# Altium project Stm32103f.PrjPcb
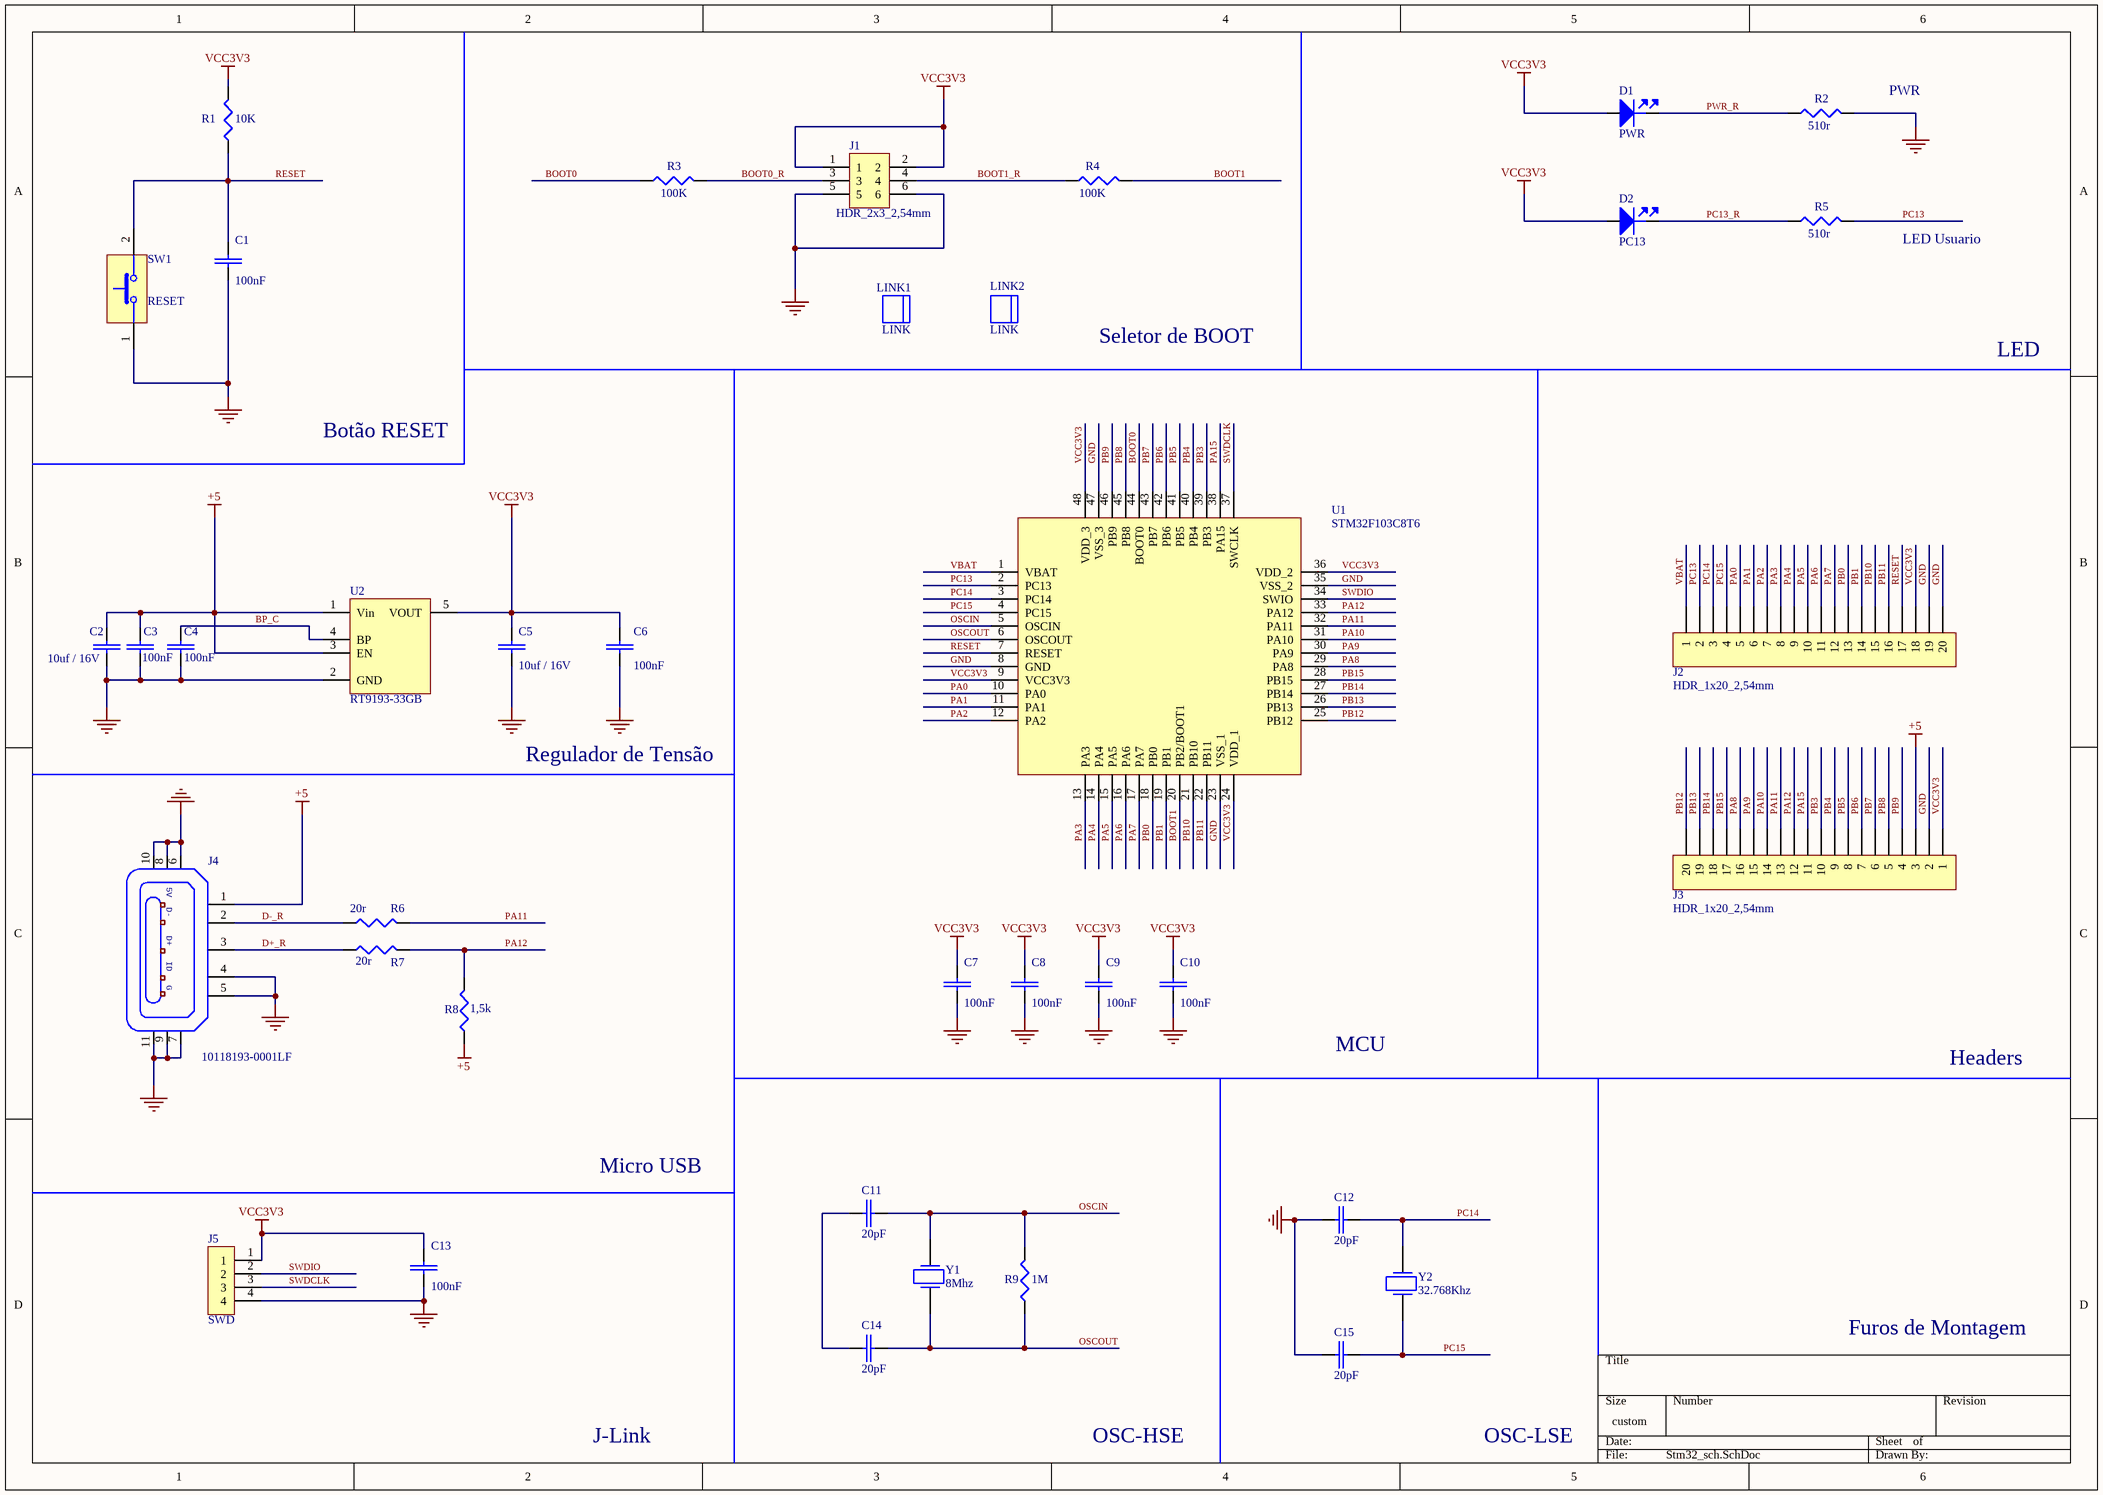
[diagram p0: Stm32_sch.SchDoc]
1 sheet, 38 parts. Net scope: global (net labels, ports and power ports of the same name join across sheets).
Board files: Stm32_pcb_Variante_2lados.PcbDoc, Stm32_pcb.PcbDoc

## Sheet Stm32_sch.SchDoc
size 393 x 279 mm; SheetNumber: 1; SheetTotal: 1

### Parts
C1  100nF  [CP-0603]
C2  10uf / 16V  [CP_0805]
C3  100nF  [CP-0603]
C4  100nF  [CP-0603]
C5  10uf / 16V  [CP_0805]
C6  100nF  [CP-0603]
C7  100nF  [CP-0603]
C8  100nF  [CP-0603]
C9  100nF  [CP-0603]
C10  100nF  [CP-0603]
C11  20pF  [CP-0603]
C12  20pF  [CP-0603]
C13  100nF  [CP-0603]
C14  20pF  [CP-0603]
C15  20pF  [CP-0603]
D1  PWR  [LED_Green]
D2  PC13  [LED_Orange]
J1  HDR_2x3_2,54mm  [Header Male 2x3 2,54mm]
J2  HDR_1x20_2,54mm  [HDR_1x20_2,54mm]
J3  HDR_1x20_2,54mm  [HDR2_1x20_2,54mm]
J4  10118193-0001LF  [Micro-Usb]
J5  SWD  [HDR_M 1x4 2.54mm]
LINK1  LINK  (mechanical)
LINK2  LINK  (mechanical)
R1  10K  [R-0603]
R2  510r  [R-0603]
R3  100K  [R-0603]
R4  100K  [R-0603]
R5  510r  [R-0603]
R6  20r  [R-0603]
R7  20r  [R-0603]
R8  1,5k  [R-0603]
R9  1M  [R-0603]
SW1  RESET  [Push Button]
U1  STM32F103C8T6  [Stm32f1]
U2  RT9193-33GB  [SOT_23_5]
Y1  8Mhz  [CK_8Mhz]
Y2  32.768Khz  [CK_32.768Khz]

### Nets
+5: C2.2 C3.2 J3.3 J4.1 R8.1 U2.1(Vin) U2.3(EN)
GND: C1.1 C2.1 C3.1 C4.1 C5.1 C6.1 C7.1 C8.1 C9.1 C10.1 C12.1 C13.1 C15.1 J1.5 J1.6 J2.19 J2.20 J3.2 J4.4 J4.5 J4.6 J4.7 J4.8 J4.9 J4.10 J4.11 J5.4 R2.2 SW1.1 U1.8(GND) U1.23(VSS_1) U1.35(VSS_2) U1.47(VSS_3) U2.2(GND)
VCC3V3: C5.2 C6.2 C7.2 C8.2 C9.2 C10.2 C13.2 D1.2(ANODE) D2.2(ANODE) J1.1 J1.2 J2.18 J3.1 J5.1 R1.2 U1.9(VCC3V3) U1.24(VDD_1) U1.36(VDD_2) U1.48(VDD_3) U2.5(VOUT)
BOOT0: R3.1 U1.44(BOOT0)
BOOT0_R: J1.3 R3.2
BOOT1: R4.2 U1.20(PB2/BOOT1)
BOOT1_R: J1.4 R4.1
BP_C: C4.2 U2.4(BP)
D+_R: J4.3 R7.1
D-_R: J4.2 R6.1
OSCIN: C11.2 R9.2 U1.5(OSCIN) Y1.2
OSCOUT: C14.2 R9.1 U1.6(OSCOUT) Y1.1
PA0: J2.5 U1.10(PA0)
PA1: J2.6 U1.11(PA1)
PA2: J2.7 U1.12(PA2)
PA3: J2.8 U1.13(PA3)
PA4: J2.9 U1.14(PA4)
PA5: J2.10 U1.15(PA5)
PA6: J2.11 U1.16(PA6)
PA7: J2.12 U1.17(PA7)
PA8: J3.16 U1.29(PA8)
PA9: J3.15 U1.30(PA9)
PA10: J3.14 U1.31(PA10)
PA11: J3.13 R6.2 U1.32(PA11)
PA12: J3.12 R7.2 R8.2 U1.33(PA12)
PA15: J3.11 U1.38(PA15)
PB0: J2.13 U1.18(PB0)
PB1: J2.14 U1.19(PB1)
PB3: J3.10 U1.39(PB3)
PB4: J3.9 U1.40(PB4)
PB5: J3.8 U1.41(PB5)
PB6: J3.7 U1.42(PB6)
PB7: J3.6 U1.43(PB7)
PB8: J3.5 U1.45(PB8)
PB9: J3.4 U1.46(PB9)
PB10: J2.15 U1.21(PB10)
PB11: J2.16 U1.22(PB11)
PB12: J3.20 U1.25(PB12)
PB13: J3.19 U1.26(PB13)
PB14: J3.18 U1.27(PB14)
PB15: J3.17 U1.28(PB15)
PC13: J2.2 R5.2 U1.2(PC13)
PC13_R: D2.1(KAT) R5.1
PC14: C12.2 J2.3 U1.3(PC14) Y2.2
PC15: C15.2 J2.4 U1.4(PC15) Y2.1
PWR_R: D1.1(KAT) R2.1
RESET: C1.2 J2.17 R1.1 SW1.2 U1.7(RESET)
SWDCLK: J5.3 U1.37(SWCLK)
SWDIO: J5.2 U1.34(SWIO)
VBAT: J2.1 U1.1(VBAT)
NetC11_1: C11.1 C14.1

### Notes on the sheet
- (near R2) PWR
- LED Usuario
- Seletor de BOOT
- LED
- Botão RESET
- Regulador de Tensão
- MCU
- Headers
- Micro USB
- Furos de Montagem
- J-Link
- OSC-HSE
- OSC-LSE
- (in symbol Micro-Usb) 5V; D-; D+; ID; G

### Library data of the parts
C1 C3 C4 C6-C10 C13 = C-0603_100nF: Multilayer Ceramic Capacitors (MLCC) - SMD/SMT 50volts 0.1uF X7R 10%; Manufacturer: KEMET; Manufacturer Part Number: C0603C104K5RACTU; Voltage Rating (DC): 50V; Dissipation Factor: 2.5%; Supplier 1: Digi-Key; RoHS: Yes; Category: Ceramic Capacitors; Stock 1: 8270795; Pricing 1: 1=0,11000, 10=0,08100, 50=0,04400, 100=0,03600, 500=0,02572, 1000=0,02021 (USD); Mount: Surface Mount; Case/Package: 0603; Number of Pins: 2; Case Code (Metric): 1608; Case Code (Imperial): 0603; Contact Plating: Tin,Matte; Dielectric Material: Ceramic; Min Operating Temperature: -55°C; Max Operating Temperature: 125°C; Capacitance: 100nF; Tolerance: 10%; Dielectric: X7R; Voltage Rating: 50V; Packaging: Tape and Reel; Package Quantity: 1; Termination: SMD/SMT; Voltage: 50V; Series: SMD Comm X7R; Length: 0.063inch; Width: 0.031inch; Height: 0.8mm; Thickness: 0.034inch; Lead Pitch: 0.7mm; Depth: 0.8mm; Radiation Hardening: No; REACH SVHC: No SVHC; RoHS Compliant: Yes; Supplier Part Number 1: 399-C0603C104K5RAC7867CT-ND
C2 C5 = C-0805 10uF / 16V: TDK - C2012X5R1C106M085AC - SMD Multilayer Ceramic Capacitor, 10 µF, 16 V, 0805 [2012 Metric], ± 20%, X5R, C Series TDK; Supplier 1: Digi-Key; Manufacturer: TDK; Manufacturer Part Number: C2012X5R1C106M085AC; RoHS: Yes; Category: Ceramic Capacitors; Stock 1: 520514; Pricing 1: 1=0,28000, 10=0,19000, 50=0,11380, 100=0,09610, 500=0,06578, 1000=0,05819 (USD); Mount: Surface Mount; Case/Package: 0805; Number of Pins: 2; Case Code (Metric): 2012; Case Code (Imperial): 0805; Weight: 0.000194oz; Dielectric Material: Ceramic; Min Operating Temperature: -55°C; Max Operating Temperature: 85°C; Packaging: Tape and Reel; Capacitance: 10uF; Voltage Rating: 16V; Tolerance: 20%; Termination: SMD/SMT; Package Quantity: 4000; Voltage Rating (DC): 16V; Dielectric: X5R; Resistor Type: Ceramic; Series: C; Construction: Flat; Voltage: 16V; Length: 2mm; Width: 0.049inch; Height: 0.85mm; Thickness: 0.037inch; Depth: 1.25mm; REACH SVHC: No SVHC; Lead Free: Lead Free; ComponentLink1URL: https://datasheet.ciiva.com/24218/c2012x5r1c106m085ac-265002-24218340.pdf?src-supplier=Mouser; ComponentLink1Description: https://datasheet.ciiva.com/24218/c2012x5r1c106m085ac-265002-24218340.pdf?src-supplier=Mouser; ComponentLink2URL: https://datasheet.ciiva.com/11788/0900766b80c1bb00-11788108.pdf?src-supplier=RSComponents; ComponentLink2Description: https://datasheet.ciiva.com/11788/0900766b80c1bb00-11788108.pdf?src-supplier=RSComponents; ComponentLink3URL: https://datasheet.ciiva.com/6290/tdkmlcccaprange-6290487.pdf?src-supplier=Digi-Key; ComponentLink3Description: https://datasheet.ciiva.com/6290/tdkmlcccaprange-6290487.pdf?src-supplier=Digi-Key; ComponentLink4URL: https://datasheet.ciiva.com/6290/tdkmlcccaprange-6290485.pdf?src-supplier=Digi-Key; ComponentLink4Description: https://datasheet.ciiva.com/6290/tdkmlcccaprange-6290485.pdf?src-supplier=Digi-Key; ComponentLink5URL: https://datasheet.ciiva.com/16449/e412-c-16449591.pdf?src-supplier=Future+Electronics; ComponentLink5Description: https://datasheet.ciiva.com/16449/e412-c-16449591.pdf?src-supplier=Future+Electronics; ComponentLink6URL: https://datasheet.ciiva.com/22725/1913358-22725557.pdf?src-supplier=Element14; ComponentLink6Description: https://datasheet.ciiva.com/22725/1913358-22725557.pdf?src-supplier=Element14; ComponentLink7URL: https://datasheet.ciiva.com/23803/1796654-23803021.pdf?src-supplier=Newark; ComponentLink7Description: https://datasheet.ciiva.com/23803/1796654-23803021.pdf?src-supplier=Newark; Supplier Part Number 1: 445-7645-1-ND
C11 C12 C14 C15 = C-0603_20pF: Cap Ceramic 20pF 50V C0G 2% SMD 0603 125°C Paper T/R; Manufacturer: KEMET; Manufacturer Part Number: C0603C200G5GAC7867; Supplier 1: Digi-Key; RoHS: Yes; Category: Ceramic Capacitors; Stock 1: 1306; Pricing 1: 1=0,68000, 10=0,47800, 50=0,36140, 100=0,31470, 500=0,23310, 1000=0,19814 (USD); Mount: Surface Mount; Case/Package: 0603; Dielectric Material: Ceramic; Min Operating Temperature: -55°C; Max Operating Temperature: 125°C; Capacitance: 20pF; Tolerance: 2%; Dielectric: C0G; Voltage Rating (DC): 50V; Length: 1.6mm; Height: 0.8mm; Depth: 0.8mm; Radiation Hardening: No; Lead Free: Lead Free; ComponentLink1URL: https://api.kemet.com/component-edge/download/datasheet/C0603C200G5GACTU.pdf?src-supplier=Digi-Key; ComponentLink1Description: https://api.kemet.com/component-edge/download/datasheet/C0603C200G5GACTU.pdf?src-supplier=Digi-Key; ComponentLink2URL: http://capacitoredge.kemet.com/capedge2/DataSheet?pn=C0603C200G5GAC7867; ComponentLink2Description: http://capacitoredge.kemet.com/capedge2/DataSheet?pn=C0603C200G5GAC7867; Supplier Part Number 1: 399-14497-1-ND
D1 = LED_Green: LED Uni-Color Green 2-Pin Chip 0603(1608Metric) T/R; Manufacturer: Osram Opto; Manufacturer Part Number: LG Q396-PS-35; Lens Color: White; Dominant Wavelength: 573nm; Lens Style: Flat,Rectangular; Lens Transparency: Diffused; Luminous Intensity: 163mcd; Test Current: 20mA; Viewing Angle: 120°; Forward Voltage: 2V; Lens Size: 0.8mm; Supplier 1: Digi-Key; RoHS: Yes; Category: LEDs; Mount: Surface Mount; Case/Package: 0603; Color: Green; Case Code (Imperial): 0603; Case Code (Metric): 1608; Packaging: Tape and Reel; Forward Current: 20mA; Wavelength: 573nm; Length: 1.6mm; Width: 0.8mm; Height: 0.4mm; REACH SVHC: No SVHC; RoHS Compliant: Yes; ComponentLink1URL: http://www.farnell.com/datasheets/2057314.pdf?src-supplier=Farnell; ComponentLink1Description: http://www.farnell.com/datasheets/2057314.pdf?src-supplier=Farnell; ComponentLink2URL: http://www.farnell.com/datasheets/2057314.pdf?src-supplier=Element14; ComponentLink2Description: http://www.farnell.com/datasheets/2057314.pdf?src-supplier=Element14; ComponentLink3URL: https://dammedia.osram.info/media/resource/hires/osram-dam-2493948/LG%20Q396.pdf?src-supplier=Digi-Key; ComponentLink3Description: https://dammedia.osram.info/media/resource/hires/osram-dam-2493948/LG%20Q396.pdf?src-supplier=Digi-Key; ComponentLink4URL: http://www.farnell.com/datasheets/2057314.pdf?src-supplier=Newark; ComponentLink4Description: http://www.farnell.com/datasheets/2057314.pdf?src-supplier=Newark; ComponentLink5URL: http://www.osram-os.com/Graphics/XPic6/00153197_0.pdf?src-supplier=Digi-Key; ComponentLink5Description: http://www.osram-os.com/Graphics/XPic6/00153197_0.pdf?src-supplier=Digi-Key; Supplier Part Number 1: LGQ396-PS-35-ND
D2 = LED_Orange: Smartled Orange Lc; Manufacturer: Osram Opto; Manufacturer Part Number: LOL29K-H2K1-24-Z; Lens Color: White; Forward Current: 20mA; Forward Voltage: 2.2V; Luminous Intensity: 9mcd; Viewing Angle: 160°; Lens Style: Flat,Diffused,Colorless,Rectangular; Test Current: 2mA; Dominant Wavelength: 606nm; Luminous Flux: 0.025lm; Number of LEDs: 1; Lens Transparency: Diffused; Reverse Voltage: 12V; Lens Size: 0.8mm; Supplier 1: Arrow Electronics; RoHS: Yes; Category: Uncategorized; Mount: Surface Mount; Case/Package: 0603; Number of Pins: 2; Color: Orange; Case Code (Metric): 1608; Case Code (Imperial): 0603; Min Operating Temperature: -40°C; Max Operating Temperature: 100°C; Illumination Color: Orange; Packaging: Tape and Reel; Package Quantity: 5000; Number of Elements: 1; Series: SmartLED; Length: 1.3mm; Width: 0.8mm; Height: 0.65mm; Depth: 0.8mm; Radiation Hardening: No; RoHS Compliant: Yes; ComponentLink1URL: https://datasheet.ciiva.com/2112/00077105-0-2112905.pdf?src-supplier=Digi-Key; ComponentLink1Description: https://datasheet.ciiva.com/2112/00077105-0-2112905.pdf?src-supplier=Digi-Key; ComponentLink2URL: https://datasheet.ciiva.com/2112/00077105-0-2112904.pdf?src-supplier=Digi-Key; ComponentLink2Description: https://datasheet.ciiva.com/2112/00077105-0-2112904.pdf?src-supplier=Digi-Key; ComponentLink3URL: https://datasheet.ciiva.com/2112/00077105-0-2112906.pdf?src-supplier=Digi-Key; ComponentLink3Description: https://datasheet.ciiva.com/2112/00077105-0-2112906.pdf?src-supplier=Digi-Key; ComponentLink4URL: https://datasheet.ciiva.com/15198/getdatasheetpartid-693885-15198412.pdf?src-supplier=Verical; ComponentLink4Description: https://datasheet.ciiva.com/15198/getdatasheetpartid-693885-15198412.pdf?src-supplier=Verical; Supplier Part Number 1: LO L29K-H2K1-24-Z
J1 = HDR_2x3_2,54mm: 2.54mm (0.1") Pitch DIL Vertical PC Tail Pin Header, 8.5mm mating pin height, tin, 3+3 contacts; Manufacturer: Harwin; Manufacturer Part Number: M20-9970346; Number of Contacts: 6; Max Current Rating: 3A; Contact Resistance: 30mR; Insulation Resistance: 10GR; Connector Type: Male Pin; Row Spacing: 0.1inch; Supplier 1: Digi-Key; RoHS: Yes; Category: Headers and Wire Housings; Stock 1: 1303; Pricing 1: 1=0,44000, 10=0,37400, 100=0,29070, 500=0,24916, 1000=0,20764, 5000=0,17798, 10000=0,16611 (USD); Mount: Through Hole; Contact Plating: Tin; Contact Material: Brass,Bronze; Color: Black; Housing Color: Black; Housing Material: Nylon; Min Operating Temperature: -40°C; Max Operating Temperature: 105°C; Number of Rows: 2; Termination: Solder; Package Quantity: 1000; Current Rating: 3A; Number of Positions: 6; Packaging: Bulk; Orientation: Straight; Series: M20; Contact Type: Male Pin; Length: 7.62mm; Pitch: 2.54mm; Contact Mating Length: 0.335inch; Depth: 5.08mm; REACH SVHC: No SVHC; ComponentLink1URL: https://datasheet.ciiva.com/5162/m20-997-351477-5162774.pdf?src-supplier=Mouser; ComponentLink1Description: https://datasheet.ciiva.com/5162/m20-997-351477-5162774.pdf?src-supplier=Mouser; ComponentLink2URL: https://datasheet.ciiva.com/11747/0900766b80da602a-11747466.pdf?src-supplier=RSComponents; ComponentLink2Description: https://datasheet.ciiva.com/11747/0900766b80da602a-11747466.pdf?src-supplier=RSComponents; Supplier Part Number 1: 952-3290-ND
J2 = HDR_1x20_p1: 2.54mm (0.1") Pitch SIL Vertical PC Tail Pin Header, 6.1mm mating pin height, tin, 20 contacts; Manufacturer: Harwin; Manufacturer Part Number: M20-9992046; Number of Contacts: 20; Current Rating: 3A; Contact Resistance: 30mR; Gender: Male; Insulation Resistance: 10GR; Connector Type: Male Pin; Supplier 1: Digi-Key; RoHS: Yes; Category: Headers and Wire Housings; Stock 1: 425; Pricing 1: 1=0,81000, 10=0,70300, 100=0,57960, 500=0,50400, 1000=0,41580, 5000=0,36540, 10000=0,34020 (USD); Mount: Through Hole; Case/Package: SIL; Contact Plating: Tin; Contact Material: Brass,Bronze; Color: Black; Housing Color: Black; Housing Material: Nylon; Min Operating Temperature: -40°C; Max Operating Temperature: 105°C; Number of Rows: 1; Termination: Solder; Max Current Rating: 3A; Package Quantity: 200; Packaging: Bulk; Number of Positions: 20; Orientation: Straight; Series: M20; Contact Type: Male Pin; Length: 50.8mm; Pitch: 2.54mm; Contact Mating Length: 0.24inch; Depth: 2.54mm; REACH SVHC: No SVHC; RoHS Compliant: Yes; ComponentLink1URL: https://datasheet.ciiva.com/11746/0900766b80da602d-11746823.pdf?src-supplier=RSComponents; ComponentLink1Description: https://datasheet.ciiva.com/11746/0900766b80da602d-11746823.pdf?src-supplier=RSComponents; ComponentLink2URL: https://datasheet.ciiva.com/9480/m20-999-9480261.pdf?src-supplier=Avnet; ComponentLink2Description: https://datasheet.ciiva.com/9480/m20-999-9480261.pdf?src-supplier=Avnet; ComponentLink3URL: https://datasheet.ciiva.com/5162/m20-999-351179-5162878.pdf?src-supplier=Mouser; ComponentLink3Description: https://datasheet.ciiva.com/5162/m20-999-351179-5162878.pdf?src-supplier=Mouser; ComponentLink4URL: https://datasheet.ciiva.com/6814/m20-999-6814908.pdf?src-supplier=Digi-Key; ComponentLink4Description: https://datasheet.ciiva.com/6814/m20-999-6814908.pdf?src-supplier=Digi-Key; ComponentLink5URL: https://datasheet.ciiva.com/8046/315376-8046943.pdf?src-supplier=Element14; ComponentLink5Description: https://datasheet.ciiva.com/8046/315376-8046943.pdf?src-supplier=Element14; Supplier Part Number 1: 952-1902-ND
J3 = HDR_1x20_p2: 2.54mm (0.1") Pitch SIL Vertical PC Tail Pin Header, 6.1mm mating pin height, tin, 20 contacts; Manufacturer: Harwin; Manufacturer Part Number: M20-9992046; Number of Contacts: 20; Current Rating: 3A; Contact Resistance: 30mR; Gender: Male; Insulation Resistance: 10GR; Connector Type: Male Pin; Supplier 1: Digi-Key; RoHS: Yes; Category: Headers and Wire Housings; Stock 1: 425; Pricing 1: 1=0,81000, 10=0,70300, 100=0,57960, 500=0,50400, 1000=0,41580, 5000=0,36540, 10000=0,34020 (USD); Mount: Through Hole; Case/Package: SIL; Contact Plating: Tin; Contact Material: Brass,Bronze; Color: Black; Housing Color: Black; Housing Material: Nylon; Min Operating Temperature: -40°C; Max Operating Temperature: 105°C; Number of Rows: 1; Termination: Solder; Max Current Rating: 3A; Package Quantity: 200; Packaging: Bulk; Number of Positions: 20; Orientation: Straight; Series: M20; Contact Type: Male Pin; Length: 50.8mm; Pitch: 2.54mm; Contact Mating Length: 0.24inch; Depth: 2.54mm; REACH SVHC: No SVHC; RoHS Compliant: Yes; ComponentLink1URL: https://datasheet.ciiva.com/11746/0900766b80da602d-11746823.pdf?src-supplier=RSComponents; ComponentLink1Description: https://datasheet.ciiva.com/11746/0900766b80da602d-11746823.pdf?src-supplier=RSComponents; ComponentLink2URL: https://datasheet.ciiva.com/9480/m20-999-9480261.pdf?src-supplier=Avnet; ComponentLink2Description: https://datasheet.ciiva.com/9480/m20-999-9480261.pdf?src-supplier=Avnet; ComponentLink3URL: https://datasheet.ciiva.com/5162/m20-999-351179-5162878.pdf?src-supplier=Mouser; ComponentLink3Description: https://datasheet.ciiva.com/5162/m20-999-351179-5162878.pdf?src-supplier=Mouser; ComponentLink4URL: https://datasheet.ciiva.com/6814/m20-999-6814908.pdf?src-supplier=Digi-Key; ComponentLink4Description: https://datasheet.ciiva.com/6814/m20-999-6814908.pdf?src-supplier=Digi-Key; ComponentLink5URL: https://datasheet.ciiva.com/8046/315376-8046943.pdf?src-supplier=Element14; ComponentLink5Description: https://datasheet.ciiva.com/8046/315376-8046943.pdf?src-supplier=Element14; Supplier Part Number 1: 952-1902-ND
J4 = Micro-Usb: FCI Right Angle Surface Mount Mount Female USB Connector; 100 V ac; 1.8A; Manufacturer: Amphenol ICC / FCI; Supplier 1: Avnet; Manufacturer Part Number: 10118193-0001LF; RoHS: No; Category: USB Connectors; Stock 1: 17288; Pricing 1: 1=0,53800, 25=0,38000, 100=0,36700, 250=0,34300, 500=0,31900 (USD); ComponentLink1URL: http://uk.rs-online.com/webdocs/1450/0900766b814507f1.pdf?src-supplier=RSComponents; ComponentLink1Description: http://uk.rs-online.com/webdocs/1450/0900766b814507f1.pdf?src-supplier=RSComponents; ComponentLink2URL: http://www.amphenol-icc.com/media/wysiwyg/files/drawing/10118193.pdf?src-supplier=Digi-Key; ComponentLink2Description: http://www.amphenol-icc.com/media/wysiwyg/files/drawing/10118193.pdf?src-supplier=Digi-Key; ComponentLink3URL: https://cdn.amphenol-icc.com/media/wysiwyg/files/documentation/datasheet/inputoutput/io_usb_micro.pdf?src-supplier=Digi-Key; ComponentLink3Description: https://cdn.amphenol-icc.com/media/wysiwyg/files/documentation/datasheet/inputoutput/io_usb_micro.pdf?src-supplier=Digi-Key; ComponentLink4URL: https://cdn.amphenol-icc.com/media/wysiwyg/files/documentation/datasheet/inputoutput/io_usb_micro.pdf?src-supplier=Verical; ComponentLink4Description: https://cdn.amphenol-icc.com/media/wysiwyg/files/documentation/datasheet/inputoutput/io_usb_micro.pdf?src-supplier=Verical; ComponentLink5URL: https://cdn.amphenol-icc.com/media/wysiwyg/files/documentation/datasheet/inputoutput/io_usb_micro.pdf?src-supplier=Onlinecomponents.com; ComponentLink5Description: https://cdn.amphenol-icc.com/media/wysiwyg/files/documentation/datasheet/inputoutput/io_usb_micro.pdf?src-supplier=Onlinecomponents.com; ComponentLink6URL: https://cdn.amphenol-icc.com/media/wysiwyg/files/documentation/datasheet/inputoutput/io_usb_micro.pdf?src-supplier=Allied+Electronics; ComponentLink6Description: https://cdn.amphenol-icc.com/media/wysiwyg/files/documentation/datasheet/inputoutput/io_usb_micro.pdf?src-supplier=Allied+Electronics; ComponentLink7URL: https://cdn.amphenol-icc.com/media/wysiwyg/files/documentation/datasheet/inputoutput/io_usb_micro.pdf?src-supplier=Avnet; ComponentLink7Description: https://cdn.amphenol-icc.com/media/wysiwyg/files/documentation/datasheet/inputoutput/io_usb_micro.pdf?src-supplier=Avnet; ComponentLink8URL: https://cdn.amphenol-icc.com/media/wysiwyg/files/documentation/datasheet/inputoutput/io_usb_micro.pdf?src-supplier=Mouser; ComponentLink8Description: https://cdn.amphenol-icc.com/media/wysiwyg/files/documentation/datasheet/inputoutput/io_usb_micro.pdf?src-supplier=Mouser; ComponentLink9URL: https://cdn.amphenol-icc.com/media/wysiwyg/files/documentation/datasheet/inputoutput/io_usb_micro.pdf?src-supplier=Arrow+Electronics; ComponentLink9Description: https://cdn.amphenol-icc.com/media/wysiwyg/files/documentation/datasheet/inputoutput/io_usb_micro.pdf?src-supplier=Arrow+Electronics; ComponentLink10URL: https://cdn.amphenol-icc.com/media/wysiwyg/files/documentation/datasheet/inputoutput/io_usb_micro.pdf?src-supplier=RSComponents; ComponentLink10Description: https://cdn.amphenol-icc.com/media/wysiwyg/files/documentation/datasheet/inputoutput/io_usb_micro.pdf?src-supplier=RSComponents; ComponentLink11URL: https://cdn.amphenol-icc.com/media/wysiwyg/files/documentation/datasheet/inputoutput/io_usb_micro.pdf?src-supplier=Heilind+Electronics; ComponentLink11Description: https://cdn.amphenol-icc.com/media/wysiwyg/files/documentation/datasheet/inputoutput/io_usb_micro.pdf?src-supplier=Heilind+Electronics; ComponentLink12URL: https://cdn.amphenol-icc.com/media/wysiwyg/files/documentation/datasheet/inputoutput/io_usb_micro.pdf?src-supplier=TTI; ComponentLink12Description: https://cdn.amphenol-icc.com/media/wysiwyg/files/documentation/datasheet/inputoutput/io_usb_micro.pdf?src-supplier=TTI; ComponentLink13URL: https://cdn.amphenol-icc.com/media/wysiwyg/files/documentation/datasheet/inputoutput/io_usb_micro.pdf?src-supplier=TME; ComponentLink13Description: https://cdn.amphenol-icc.com/media/wysiwyg/files/documentation/datasheet/inputoutput/io_usb_micro.pdf?src-supplier=TME; Supplier Part Number 1: 67T2259
J5 = HDR_1x4_2.54mm: Conn Unshrouded Header HDR 4 POS 2.54mm Solder ST Top Entry Thru-Hole T/R; Manufacturer: Amphenol ICC / FCI; Manufacturer Part Number: 77311-462K04LF; Current Rating: 3A; Voltage Rating: 1.5kV; Number of Positions: 4; Insulation Resistance: 5GR; Gender: Male; Connector Type: Male Pin; Contact Post Length: 3.05mm; Supplier 1: Arrow Electronics; RoHS: Yes; Category: Headers and Wire Housings; Mount: Through Hole; Color: Black; Contact Plating: Tin; Contact Material: Bronze; Housing Color: Black; Housing Material: Thermoplastic; Min Operating Temperature: -65°C; Max Operating Temperature: 125°C; Package Quantity: 1400; Number of Rows: 1; Packaging: Tape and Reel; Contact Gender: Male; Termination: Solder; Max Voltage Rating (AC): 1.5kV; Number of Contacts: 4; Orientation: Straight; Series: BERGSTIK®, MezzSelect™, Basics+; Contact Type: Male Pin; Length: 10.16mm; Pitch: 2.54mm; Contact Mating Length: 0.531inch; Depth: 2.4mm; Radiation Hardening: No; Lead Free: Lead Free; ComponentLink1URL: https://datasheet.ciiva.com/739/77311-739277.pdf?src-supplier=Digi-Key; ComponentLink1Description: https://datasheet.ciiva.com/739/77311-739277.pdf?src-supplier=Digi-Key; ComponentLink2URL: https://datasheet.ciiva.com/739/77311-739280.pdf?src-supplier=Digi-Key; ComponentLink2Description: https://datasheet.ciiva.com/739/77311-739280.pdf?src-supplier=Digi-Key; ComponentLink3URL: https://datasheet.ciiva.com/10147/77311-10147511.pdf?src-supplier=Avnet; ComponentLink3Description: https://datasheet.ciiva.com/10147/77311-10147511.pdf?src-supplier=Avnet; Supplier Part Number 1: 77311-462K04LF
LINK1 LINK2 = COMM_Jumper: 2 Position 2.54 mm Centerline Single Circuit Open Top Jumper; Manufacturer: Sullins; Manufacturer Part Number: QPC02SXGN-RC; Number of Positions: 2; Pitch: 0.1inch; Supplier 1: Digi-Key; RoHS: Yes; Category: Connectors; Stock 1: 1076433; Pricing 1: 1=0,10000, 10=0,05000, 25=0,04080, 50=0,03780, 100=0,03650, 250=0,03152, 500=0,03024, 2000=0,02520, 4000=0,02394 (USD); Case/Package: 100; Contact Plating: Gold; Package Quantity: 2000; Packaging: Bulk; Height: 0.235inch; RoHS Compliant: Yes; Lead Free: Lead Free; ComponentLink1URL: https://datasheet.ciiva.com/767/284-sxgn-11510-767869.pdf?src-supplier=Digi-Key; ComponentLink1Description: https://datasheet.ciiva.com/767/284-sxgn-11510-767869.pdf?src-supplier=Digi-Key; Supplier Part Number 1: S9337-ND
R1 = R_0603_10K: Res Thin Film 0603 10K Ohm 0.5% 0.1W(1/10W) ±50ppm/C Epoxy SMD T/R; Manufacturer: Yageo; Manufacturer Part Number: RT0603DRE0710KL; Resistance: 10kR; Power Rating: 100mW; Voltage Rating: 75V; Temperature Coefficient: 50ppm/°C; Voltage Rating (DC): 50V; Supplier 1: Digi-Key; RoHS: Yes; Category: Chip SMD Resistors; Stock 1: 494; Pricing 1: 1=0,11000, 10=0,09600, 100=0,03700, 1000=0,01626, 2500=0,01404 (USD); Case/Package: 0603; Case Code (Metric): 1608; Case Code (Imperial): 0603; Size Code: 0603; Min Operating Temperature: -55°C; Max Operating Temperature: 125°C; Package Quantity: 5000; Packaging: Tape and Reel; Tolerance: 0.5%; Resistor Type: Thin Film; Number of Terminations: 2; Termination: SMD/SMT; Max Power Dissipation: 100mW; Features: Moisture Resistant; Series: RT; Construction: Rectangular; Length: 0.063inch; Width: 0.031inch; Height: 0.022inch; Depth: 0.8mm; RoHS Compliant: Yes; Military Standard: Not; Lead Free: Lead Free; ComponentLink1URL: https://datasheet.ciiva.com/2565/pyu-rt-1-to-0-05-rohs-l-5-2565939.pdf?src-supplier=Digi-Key; ComponentLink1Description: https://datasheet.ciiva.com/2565/pyu-rt-1-to-0-05-rohs-l-5-2565939.pdf?src-supplier=Digi-Key; Supplier Part Number 1: YAG2318CT-ND
R2 R5 = R_0603_510r: Res Thick Film 0603 510 Ohm 1% 1/10W 100ppm/C Molded SMD Paper T/R; Manufacturer: Yageo; Manufacturer Part Number: RC0603FR-07510RL; Temperature Coefficient: 100ppm/°C; Power Rating: 100mW; Voltage Rating: 75V; Voltage Rating (DC): 50V; Supplier 1: Digi-Key; RoHS: Yes; Category: Chip SMD Resistors; Stock 1: 1855476; Pricing 1: 1=0,10000, 10=0,02300, 100=0,00930, 1000=0,00417, 2500=0,00362 (USD); Case/Package: 0603; Number of Pins: 2; Contact Plating: Tin,Matte; Case Code (Imperial): 0603; Case Code (Metric): 1608; Weight: 7.1E-05oz; Size Code: 0603; Min Operating Temperature: -55°C; Max Operating Temperature: 155°C; Resistance: 510R; Tolerance: 1%; Resistor Type: Thick Film; Packaging: Tape and Reel; Termination: SMD/SMT; Features: Moisture Resistant; Series: RC; Max Power Dissipation: 100mW; Number of Terminations: 2; Resistance Tolerance: 1%; Construction: Rectangular; Technology: THICK FILM; Length: 1.6mm; Width: 0.8mm; Height: 0.45mm; Depth: 0.8mm; REACH SVHC: No SVHC; Military Standard: Not; Lead Free: Lead Free; RoHS Compliant: Yes; ComponentLink1URL: https://datasheet.ciiva.com/11808/0900766b80f96399-11808268.pdf?src-supplier=RSComponents; ComponentLink1Description: https://datasheet.ciiva.com/11808/0900766b80f96399-11808268.pdf?src-supplier=RSComponents; ComponentLink2URL: https://datasheet.ciiva.com/46395/443971-46395013.pdf?src-supplier=Element14; ComponentLink2Description: https://datasheet.ciiva.com/46395/443971-46395013.pdf?src-supplier=Element14; ComponentLink3URL: https://datasheet.ciiva.com/8883/pyu-rc0603-51-rohs-l-4-8883078.pdf?src-supplier=Avnet; ComponentLink3Description: https://datasheet.ciiva.com/8883/pyu-rc0603-51-rohs-l-4-8883078.pdf?src-supplier=Avnet; Supplier Part Number 1: 311-510HRCT-ND
R3 R4 = R_0603_100K: RES SMD 100K OHM 1% 1/10W 0603; Manufacturer: Yageo; Manufacturer Part Number: RC0603FR-07100KL; Resistance: 100kR; Temperature Coefficient: 100ppm/°C; Power Rating: 100mW; Voltage Rating: 50V; Working Voltage: 75V; Supplier 1: Digi-Key; RoHS: Yes; Category: Chip SMD Resistors; Stock 1: 18667121; Pricing 1: 1=0,10000, 10=0,02300, 100=0,00930, 1000=0,00417, 2500=0,00362 (USD); Case/Package: 0603; Number of Pins: 2; Case Code (Imperial): 0603; Case Code (Metric): 1608; Min Operating Temperature: -55°C; Max Operating Temperature: 155°C; Tolerance: 1%; Resistor Type: Thick Film; Voltage Rating (DC): 50V; Packaging: Tape and Reel; Termination: SMD/SMT; Number of Terminations: 2; Features: Moisture Resistant; Series: RC; Max Power Dissipation: 100mW; Resistance Tolerance: 1%; Construction: Rectangular; Technology: THICK FILM; Length: 1.6mm; Width: 0.8mm; Height: 0.45mm; Depth: 0.8mm; REACH SVHC: No SVHC; Military Standard: Not; Lead Free: Lead Free; RoHS Compliant: Yes; ComponentLink1URL: https://datasheet.ciiva.com/11808/0900766b80f96399-11808107.pdf?src-supplier=RSComponents; ComponentLink1Description: https://datasheet.ciiva.com/11808/0900766b80f96399-11808107.pdf?src-supplier=RSComponents; ComponentLink2URL: https://datasheet.ciiva.com/7983/443971-7983593.pdf?src-supplier=Element14; ComponentLink2Description: https://datasheet.ciiva.com/7983/443971-7983593.pdf?src-supplier=Element14; ComponentLink3URL: https://datasheet.ciiva.com/22747/443971-22747516.pdf?src-supplier=Element14; ComponentLink3Description: https://datasheet.ciiva.com/22747/443971-22747516.pdf?src-supplier=Element14; ComponentLink4URL: https://datasheet.ciiva.com/46440/1868787-46440889.pdf?src-supplier=Element14; ComponentLink4Description: https://datasheet.ciiva.com/46440/1868787-46440889.pdf?src-supplier=Element14; ComponentLink5URL: https://datasheet.ciiva.com/7746/1738695-7746235.pdf?src-supplier=Element14; ComponentLink5Description: https://datasheet.ciiva.com/7746/1738695-7746235.pdf?src-supplier=Element14; ComponentLink6URL: https://datasheet.ciiva.com/7746/1738695-7746234.pdf?src-supplier=Element14; ComponentLink6Description: https://datasheet.ciiva.com/7746/1738695-7746234.pdf?src-supplier=Element14; Supplier Part Number 1: 311-100KHRCT-ND
R6 R7 = R_0603_20r: Res Thick Film 0603 20 Ohm 1% 0.1W(1/10W) ±100ppm/C Pad SMD T/R; Manufacturer: Yageo; Manufacturer Part Number: RC0603FR-0720RL; Power Rating: 100mW; Voltage Rating: 50V; Temperature Coefficient: 100ppm/°C; Working Voltage: 75V; Supplier 1: Digi-Key; RoHS: Yes; Category: Chip SMD Resistors; Stock 1: 807169; Pricing 1: 1=0,10000, 10=0,02300, 100=0,00930, 1000=0,00417, 2500=0,00362 (USD); Case/Package: 0603; Case Code (Imperial): 0603; Case Code (Metric): 1608; Min Operating Temperature: -55°C; Max Operating Temperature: 155°C; Resistance: 20R; Tolerance: 1%; Packaging: Tape and Reel; Package Quantity: 1; Termination: SMD/SMT; Resistor Type: Thick Film; Number of Terminations: 2; Max Power Dissipation: 100mW; Voltage Rating (DC): 50V; Features: Moisture Resistant; Series: RC; Construction: Rectangular; Technology: THICK FILM; Resistance Tolerance: 1%; Length: 1.6mm; Width: 0.8mm; Height: 0.45mm; Depth: 0.8mm; REACH SVHC: No SVHC; Military Standard: Not; Lead Free: Lead Free; RoHS Compliant: Yes; ComponentLink1URL: https://datasheet.ciiva.com/11819/0900766b80f96399-11819290.pdf?src-supplier=RSComponents; ComponentLink1Description: https://datasheet.ciiva.com/11819/0900766b80f96399-11819290.pdf?src-supplier=RSComponents; ComponentLink2URL: https://datasheet.ciiva.com/46395/443971-46395031.pdf?src-supplier=Element14; ComponentLink2Description: https://datasheet.ciiva.com/46395/443971-46395031.pdf?src-supplier=Element14; ComponentLink3URL: https://datasheet.ciiva.com/2454/pyu-r-int-thick-7-2454028.pdf?src-supplier=Digi-Key; ComponentLink3Description: https://datasheet.ciiva.com/2454/pyu-r-int-thick-7-2454028.pdf?src-supplier=Digi-Key; ComponentLink4URL: https://datasheet.ciiva.com/2454/pyu-r-int-thick-7-2454029.pdf?src-supplier=Digi-Key; ComponentLink4Description: https://datasheet.ciiva.com/2454/pyu-r-int-thick-7-2454029.pdf?src-supplier=Digi-Key; ComponentLink5URL: https://datasheet.ciiva.com/2454/pyu-r-int-thick-7-2454027.pdf?src-supplier=Digi-Key; ComponentLink5Description: https://datasheet.ciiva.com/2454/pyu-r-int-thick-7-2454027.pdf?src-supplier=Digi-Key; ComponentLink6URL: https://datasheet.ciiva.com/12557/rc0603-272842-12557941.pdf?src-supplier=Mouser; ComponentLink6Description: https://datasheet.ciiva.com/12557/rc0603-272842-12557941.pdf?src-supplier=Mouser; ComponentLink7URL: https://datasheet.ciiva.com/15189/getdatasheetpartid-324013-15189653.pdf?src-supplier=Verical; ComponentLink7Description: https://datasheet.ciiva.com/15189/getdatasheetpartid-324013-15189653.pdf?src-supplier=Verical; Supplier Part Number 1: 311-20.0HRCT-ND
R8 = R_0603_1,5k: Res Thin Film 0603 1.5K Ohm 0.1% 1/10W ±25ppm/°C 0.01% Molded SMD SMD Waffle Pack; Manufacturer: Vishay Dale; Manufacturer Part Number: M55342E12B1B50RWS; Resistance: 1.5kR; Max Power Dissipation: 100mW; Supplier 1: Digi-Key; RoHS: No; Category: Chip SMD Resistors; Case/Package: 0603; Case Code (Metric): 1608; Case Code (Imperial): 0603; Contact Plating: Tin,Lead; Min Operating Temperature: -55°C; Max Operating Temperature: 150°C; Tolerance: 0.1%; Package Quantity: 1; Packaging: Waffle; Resistor Type: Thin Film; Number of Terminations: 2; Failure Rate: 0.01%; Temperature Coefficient: 25ppm/°C; Features: Military; Series: Military, MIL-PRF-55342, RM0603; Length: 0.064inch; Width: 0.032inch; Height: 0.033inch; Radiation Hardening: No; Military Standard: MIL-PRF-55342; RoHS Compliant: No; ComponentLink1URL: https://datasheet.ciiva.com/14991/eh-14991606.pdf?src-supplier=Digi-Key; ComponentLink1Description: https://datasheet.ciiva.com/14991/eh-14991606.pdf?src-supplier=Digi-Key; Supplier Part Number 1: M55342E12B1B50RWS-MIL
R9 = R_0603_1M: Res Thick Film 0603 1M Ohm 1% 1/10W ±100ppm/°C Molded SMD Paper T/R; Manufacturer: Yageo; Manufacturer Part Number: RC0603FR-071ML; Voltage Rating: 75V; Voltage Rating (DC): 50V; Resistance: 1MR; Power Rating: 100mW; Application(s): HIGH RELIABILITY; Supplier 1: Digi-Key; RoHS: Yes; Category: Chip SMD Resistors; Stock 1: 2868696; Pricing 1: 1=0,10000, 10=0,02300, 100=0,00930, 1000=0,00417, 2500=0,00362 (USD); Case/Package: 0603; Number of Pins: 2; Case Code (Imperial): 0603; Case Code (Metric): 1608; Weight: 0.000847oz; Min Operating Temperature: -55°C; Max Operating Temperature: 155°C; Tolerance: 1%; Packaging: Cut Tape; Package Quantity: 5000; Termination: SMD/SMT; Resistor Type: Thick Film; Temperature Coefficient: 100ppm/°C; Type: General Purpose; Series: RC; Technology: THICK FILM; Length: 1.6mm; Width: 0.8mm; Height: 0.45mm; Depth: 0.8mm; RoHS Compliant: Yes; REACH SVHC: No SVHC; Military Standard: Not; Lead Free: Lead Free; ComponentLink1URL: https://datasheet.ciiva.com/11819/0900766b80f96399-11819295.pdf?src-supplier=RSComponents; ComponentLink1Description: https://datasheet.ciiva.com/11819/0900766b80f96399-11819295.pdf?src-supplier=RSComponents; ComponentLink2URL: https://datasheet.ciiva.com/7983/443971-7983614.pdf?src-supplier=Element14; ComponentLink2Description: https://datasheet.ciiva.com/7983/443971-7983614.pdf?src-supplier=Element14; ComponentLink3URL: https://datasheet.ciiva.com/12555/rc0603-272842-12555388.pdf?src-supplier=Mouser; ComponentLink3Description: https://datasheet.ciiva.com/12555/rc0603-272842-12555388.pdf?src-supplier=Mouser; Supplier Part Number 1: 311-1.00MHRCT-ND
SW1 = Button N/O: Switch Tactile N.O. SPST Rectangular Button F-Lead 0.05A 12VDC 2.45N SMD T/R; Manufacturer: ITT C&K; Manufacturer Part Number: PTS636SK25FSMTRLFS; Supplier 1: Digi-Key; RoHS: No; Stock 1: 25598; Pricing 1: 1=0,18000, 10=0,17400, 25=0,16480, 100=0,14980, 250=0,14080, 500=0,12882, 1000=0,10786 (USD); Supplier Part Number 1: CKN12330-1-ND
U1 = STM32F103C8T6: IC MCU 32BIT 64KB FLASH 48LQFP; Manufacturer: STMicroelectronics; RAM Size: 20KB; Frequency: 72MHz; Max Power Dissipation: 363mW; Interface: I2C,SPI,USB,CAN,USART; Number of I/Os: 37; Number of Timers/Counters: 3; Max Supply Voltage: 3.6V; Number of ADC Channels: 10; Min Supply Voltage: 2V; Oscillator Type: Internal; Number of Programmable I/O: 48; Data Bus Width: 32b; Number of Bits: 32; Watchdog Timer: Yes; Peripherals: POR,PWM,WDT,DMA,Temp Sensor,I2C; Core Architecture: ARM; Number of PWM Channels: 1; Number of SPI Channels: 2; Supplier 1: Digi-Key; Manufacturer Part Number: STM32F103C8T6; RoHS: Yes; Category: Microcontrollers; Case/Package: LQFP; Number of Pins: 48; Weight: 0.006349oz; Min Operating Temperature: -40°C; Max Operating Temperature: 85°C; Packaging: Tray; Package Quantity: 1500; Density: 64KB; Memory Type: FLASH; Max Frequency: 72MHz; Memory Size: 64KB; Series: STM32F103C8; Termination: SMD/SMT; Number of I2C Channels: 2; Address Bus Width: 32b; Length: 7mm; Width: 7mm; Height: 1.4mm; Radiation Hardening: No; Lead Free: Lead Free; REACH SVHC: No SVHC; RoHS Compliant: Yes; ComponentLink1URL: https://datasheet.ciiva.com/15122/getdatasheetpartid-69880-15122076.pdf?src-supplier=Verical; ComponentLink1Description: https://datasheet.ciiva.com/15122/getdatasheetpartid-69880-15122076.pdf?src-supplier=Verical; ComponentLink2URL: https://datasheet.ciiva.com/8054/1730126-8054942.pdf?src-supplier=Element14; ComponentLink2Description: https://datasheet.ciiva.com/8054/1730126-8054942.pdf?src-supplier=Element14; ComponentLink3URL: https://datasheet.ciiva.com/14100/pustm-arm-microcont-stm32f103-en-14100508.pdf?src-supplier=Distrelec; ComponentLink3Description: https://datasheet.ciiva.com/14100/pustm-arm-microcont-stm32f103-en-14100508.pdf?src-supplier=Distrelec; ComponentLink4URL: https://datasheet.ciiva.com/16210/cd00161566-16210248.pdf?src-supplier=Future+Electronics; ComponentLink4Description: https://datasheet.ciiva.com/16210/cd00161566-16210248.pdf?src-supplier=Future+Electronics; ComponentLink5URL: https://datasheet.ciiva.com/48687/001075658-da-01-en-mcu-64kb-mem-stm32f103c8t6-lqfp-48-stm-48687589.pdf?src-supplier=Conrad; ComponentLink5Description: https://datasheet.ciiva.com/48687/001075658-da-01-en-mcu-64kb-mem-stm32f103c8t6-lqfp-48-stm-48687589.pdf?src-supplier=Conrad; Supplier Part Number 1: 497-6063-ND
U2 = RT9193-33GB: IC REG LDO 3.3V 0.3A SOT23-5; Manufacturer: Richtek; Dropout Voltage: 220mV; Min Input Voltage: 2.5V; Max Input Voltage: 5.5V; Output Current: 300mA; Number of Regulators: 1; Min Current Limit: 360mA; Supplier 1: Digi-Key; Manufacturer Part Number: RT9193-33GB; RoHS: Yes; Category: Voltage Regulators - Linear; Stock 1: 13168; Pricing 1: 1=0,50000, 10=0,40900, 25=0,37360, 100=0,27810, 250=0,25208, 500=0,20860, 1000=0,15646 (USD); Mount: Surface Mount; Case/Package: SOT-23-5; Number of Pins: 5; Min Operating Temperature: -40°C; Max Operating Temperature: 125°C; Packaging: Tape and Reel; Nominal Output Voltage: 3.3V; Output Voltage: 3.3V; Series: -; REACH SVHC: Unknown; Lead Free: Lead Free; RoHS Compliant: Yes; ComponentLink1URL: https://datasheet.ciiva.com/2046/3d3futf-83fb3frfm5mtkzlte2lnbkzg3d3d3f3d-2046896.pdf?src-supplier=Digi-Key; ComponentLink1Description: https://datasheet.ciiva.com/2046/3d3futf-83fb3frfm5mtkzlte2lnbkzg3d3d3f3d-2046896.pdf?src-supplier=Digi-Key; ComponentLink2URL: https://datasheet.ciiva.com/28652/1782157-28652989.pdf?src-supplier=Element14; ComponentLink2Description: https://datasheet.ciiva.com/28652/1782157-28652989.pdf?src-supplier=Element14; Supplier Part Number 1: 1028-1014-1-ND
Y1 = CK_8Mhz: Crystal 8MHz ±20ppm (Tol) ±50ppm (Stability) 18pF FUND 80Ohm 2-Pin HC-49/US Thru-Hole Bulk; Manufacturer: Abracon; Manufacturer Part Number: ABL-8.000MHZ-B2; ESR (Equivalent Series Resistance): 80R; Supplier 1: Digi-Key; RoHS: Yes; Category: Resonators; Stock 1: 22979; Pricing 1: 1=0,33000, 10=0,27800, 50=0,25000, 100=0,22220, 500=0,21108, 1000=0,17776, 2500=0,16665, 5000=0,16110, 10000=0,15554 (USD); Mount: Through Hole; Number of Pins: 2; Min Operating Temperature: -20°C; Max Operating Temperature: 70°C; Frequency Tolerance: 20ppm; Load Capacitance: 18pF; Frequency: 8MHz; Frequency Stability: 50ppm; Packaging: Bulk; Package Quantity: 1000; Tolerance: 20ppm; Termination: Radial; Series Resistance: 80R; Series: ABL; Operating Frequency: 8 MHz; Length: 0.453inch; Width: 0.197inch; Height: 0.138inch; Radiation Hardening: No; Lead Free: Lead Free; REACH SVHC: No SVHC; ComponentLink1URL: https://datasheet.ciiva.com/862/abl-862079.pdf?src-supplier=Digi-Key; ComponentLink1Description: https://datasheet.ciiva.com/862/abl-862079.pdf?src-supplier=Digi-Key; ComponentLink2URL: https://datasheet.ciiva.com/7998/1359171-7998413.pdf?src-supplier=Element14; ComponentLink2Description: https://datasheet.ciiva.com/7998/1359171-7998413.pdf?src-supplier=Element14; Supplier Part Number 1: 535-9062-ND
Y2 = CK_32.768Khz: Crystal, Plastic Molded 32.768Khz, 6Pf, 10Ppm-40+85C, 8 X 3.8 X 2.5 Rohs Compliant: Yes; Manufacturer: Abracon; Manufacturer Part Number: ABS25-32.768KHZ-6-1-T; Frequency Tolerance: 10ppm; ESR (Equivalent Series Resistance): 50kR; Supplier 1: Digi-Key; RoHS: Yes; Category: Crystals; Stock 1: 153989; Pricing 1: 1=1,26000, 10=1,20600, 50=1,17800, 100=1,00980, 500=0,98176, 1000=0,82748 (USD); Mount: Surface Mount; Case/Package: SMD/SMT; Number of Pins: 4; Min Operating Temperature: -40°C; Max Operating Temperature: 85°C; Packaging: Tape and Reel; Load Capacitance: 6pF; Frequency: 32.768kHz; Package Quantity: 3000; Tolerance: 10ppm; Termination: SMD/SMT; Series: ABS25; Series Resistance: 50kR; Operating Frequency: 32.768 kHz; Length: 8mm; Width: 0.15inch; Height: 0.098inch; Depth: 3.8mm; Radiation Hardening: No; RoHS Compliant: Yes; Lead Free: Lead Free; REACH SVHC: No SVHC; ComponentLink1URL: https://datasheet.ciiva.com/854/abs25-854528.pdf?src-supplier=Avnet; ComponentLink1Description: https://datasheet.ciiva.com/854/abs25-854528.pdf?src-supplier=Avnet; ComponentLink2URL: https://datasheet.ciiva.com/854/abs25-854872.pdf?src-supplier=Digi-Key; ComponentLink2Description: https://datasheet.ciiva.com/854/abs25-854872.pdf?src-supplier=Digi-Key; ComponentLink3URL: https://datasheet.ciiva.com/854/abs25-854873.pdf?src-supplier=Digi-Key; ComponentLink3Description: https://datasheet.ciiva.com/854/abs25-854873.pdf?src-supplier=Digi-Key; ComponentLink4URL: https://datasheet.ciiva.com/854/abs25-854874.pdf?src-supplier=Digi-Key; ComponentLink4Description: https://datasheet.ciiva.com/854/abs25-854874.pdf?src-supplier=Digi-Key; ComponentLink5URL: https://datasheet.ciiva.com/4944/abs25-35653-4944891.pdf?src-supplier=Mouser; ComponentLink5Description: https://datasheet.ciiva.com/4944/abs25-35653-4944891.pdf?src-supplier=Mouser; ComponentLink6URL: https://datasheet.ciiva.com/16416/abs25-16416758.pdf?src-supplier=Future+Electronics; ComponentLink6Description: https://datasheet.ciiva.com/16416/abs25-16416758.pdf?src-supplier=Future+Electronics; ComponentLink7URL: https://datasheet.ciiva.com/1357/1856019-1357323.pdf?src-supplier=Element14; ComponentLink7Description: https://datasheet.ciiva.com/1357/1856019-1357323.pdf?src-supplier=Element14; Supplier Part Number 1: 535-10241-1-ND